# EasyEDA Pro project stm32f103c8t6.eprj, schematic Schematic1
Board Name: Board1; Create Date: 2025-10-09; Page Name: P1; Project Name: 降压模块; Schematic Name: Schematic1; Update Date: 2025-10-12; Company: 嘉立创EDA; Page Size: A4; Version: V1.0
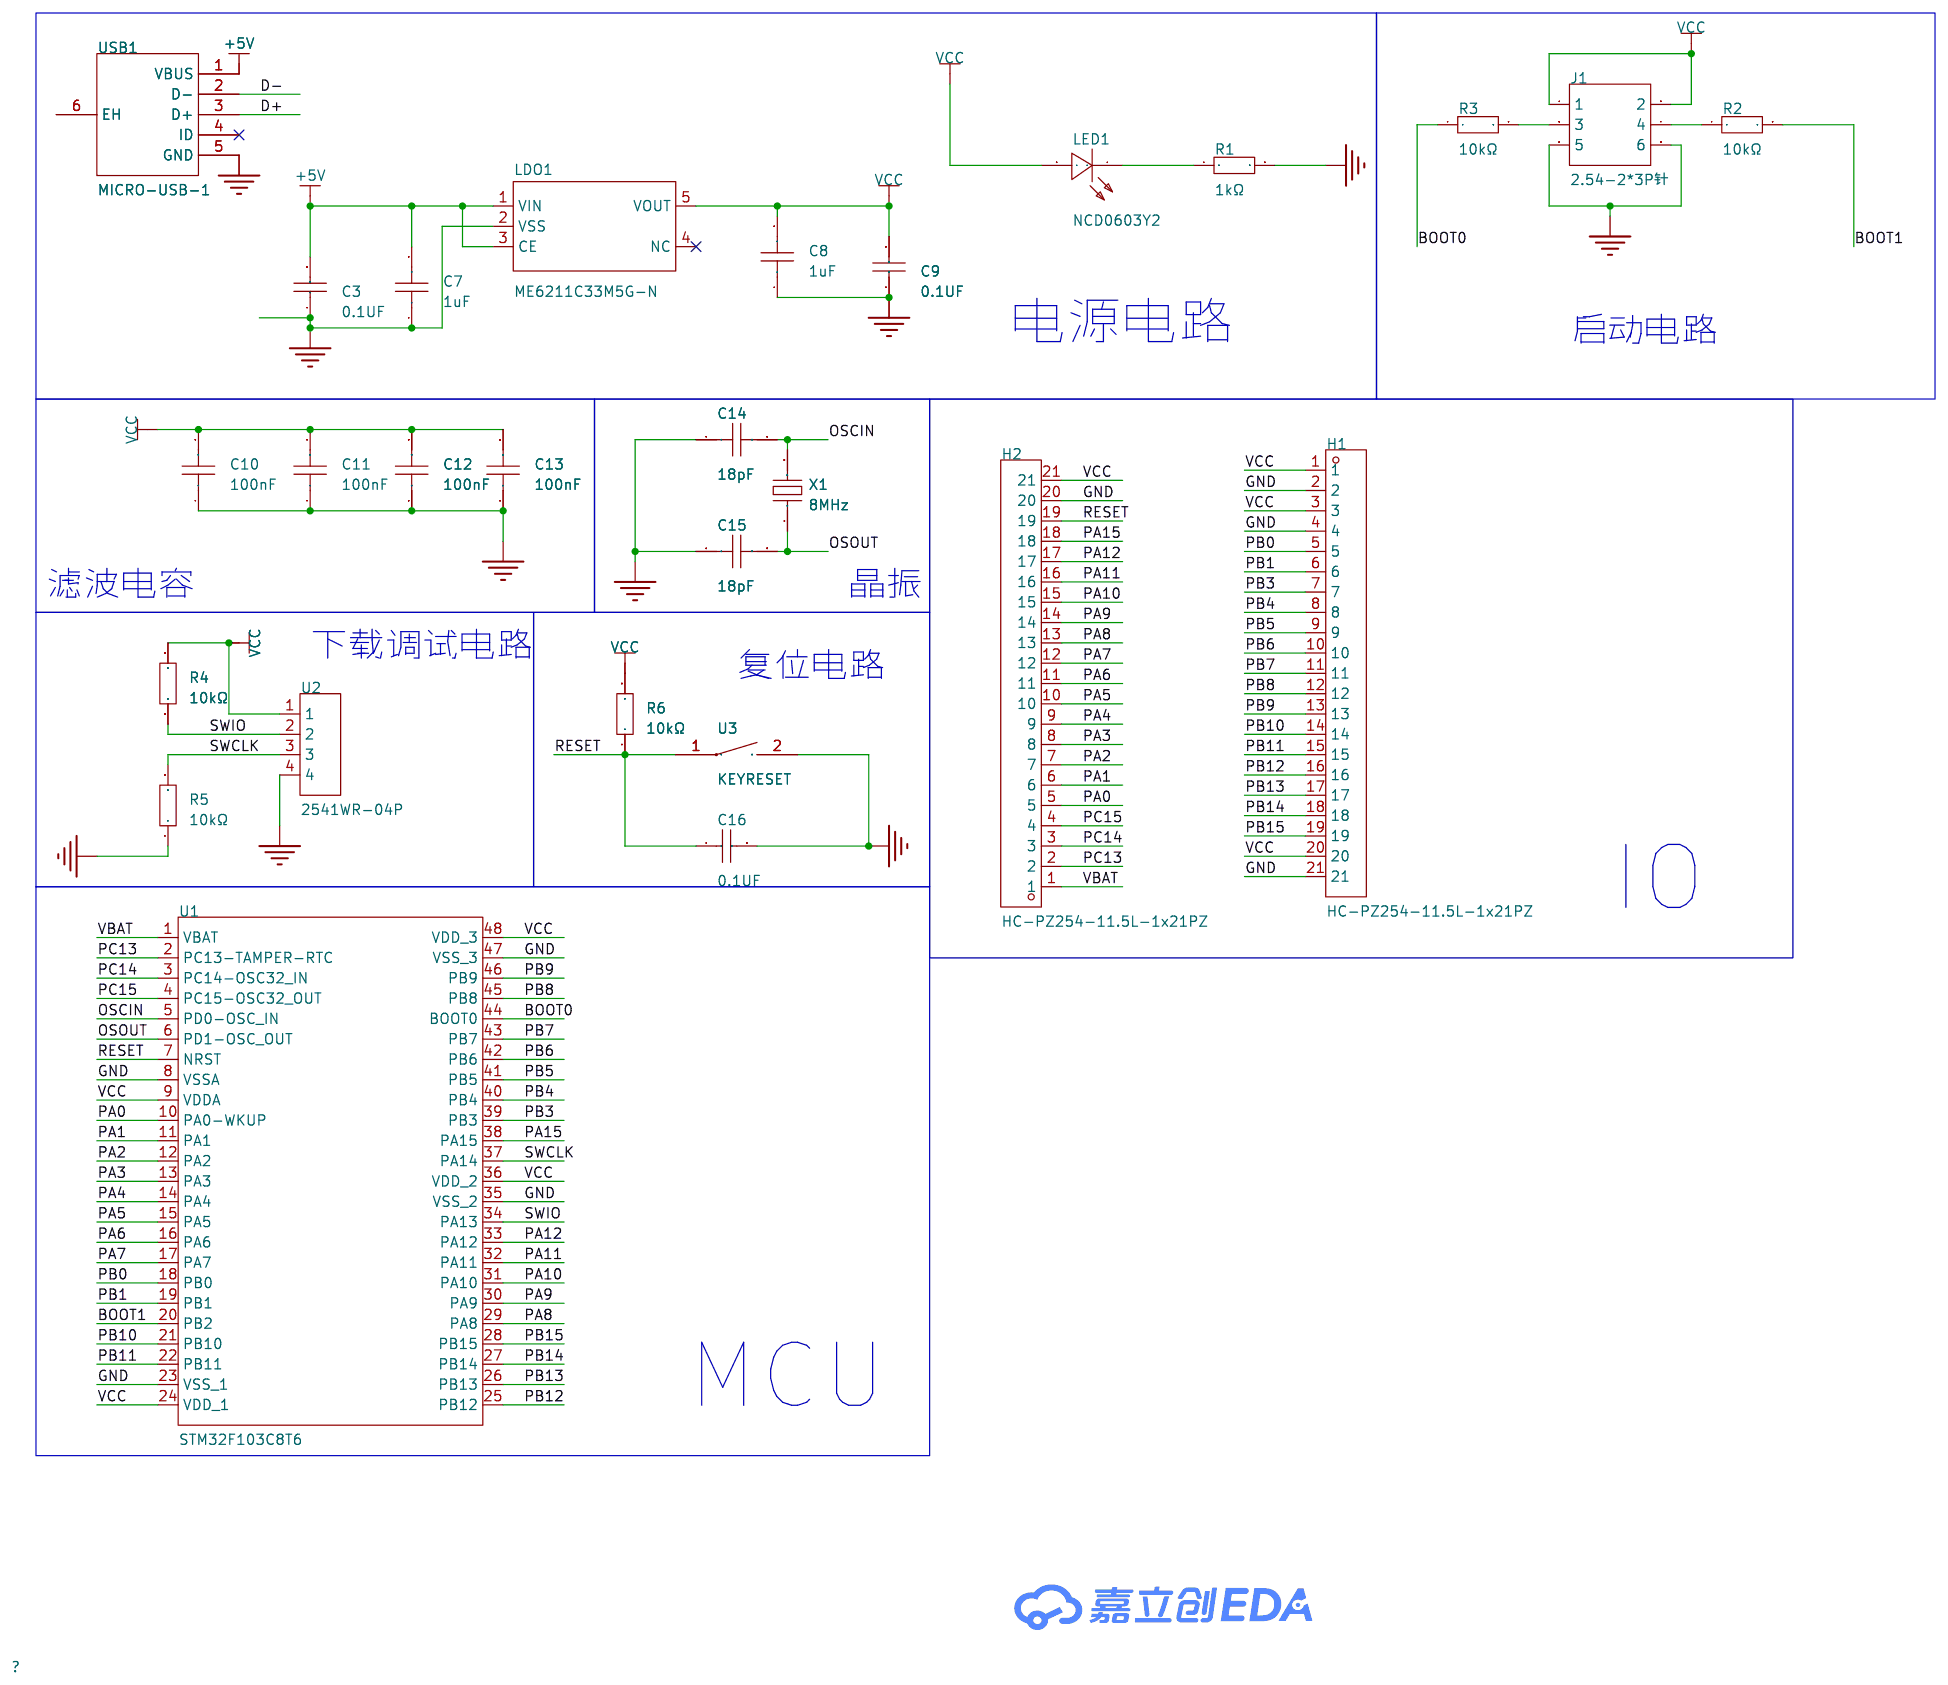
[diagram p0: schematic sheet]

## Parts
C3  0.1UF  [C0603]
C7  1uF  [C0603]
C8  1uF  [C0603]
C9  0.1UF  [C0603]
C10  100nF  [C0402]
C11  100nF  [C0402]
C12  100nF  [C0402]
C13  100nF  [C0402]
C14  18pF  [C0603]
C15  18pF  [C0603]
C16  0.1UF  [C0603]
H1  HC-PZ254-11.5L-1x21PZ  [HDR-TH_21P-P2.54-V-M]
H2  HC-PZ254-11.5L-1x21PZ  [HDR-TH_21P-P2.54-V-M]
J1  2.54-2*3P针  [HDR-TH_6P-P2.54-V-M-R2-C3-S2.54-1]
LDO1  ME6211C33M5G-N  [SOT-23-5_L3.0-W1.7-P0.95-LS2.8-BL]
LED1  NCD0603Y2  [LED0603-RD]
R1  1kΩ  [R0603]
R2  10kΩ  [R0603]
R3  10kΩ  [R0603]
R4  10kΩ  [R0603]
R5  10kΩ  [R0603]
R6  10kΩ  [R0603]
U1  STM32F103C8T6  [LQFP-48_L7.0-W7.0-P0.50-LS9.0-BL]
U2  2541WR-04P  [HDR-TH_4P-P2.54-H-M-W10.4-N]
U3  KEYRESET  [SW-SMD_HX-TS-1101-C-W]
USB1  MICRO-USB-1  [MICRO-USB-SMD_C9900008946]
X1  8MHz  [CRYSTAL-SMD_L7.0-W4.1-LS7.6]

## Library data of the parts
C3 C9 C16 = CAPCER0.1UF16VX5R0603,CAPCER0.1UF25VX5R0603,CAPCER0.1UF16VX7R0603: Supplier Part: C9900012833; JLCPCB Part Class: Extended Part; Supplier: LCSC
C7 C8 = CL10A105KB8NNNC: 容值:1uF;精度:±10%;额定电压:50V;温度系数:X5R;; LCSC Part Name: 1uF ±10% 50V; Supplier Part: C15849; Manufacturer: SAMSUNG(三星); Supplier Footprint: 0603; JLCPCB Part Class: Basic Part; Datasheet: https://item.szlcsc.com/datasheet/CL10A105KB8NNNC/16531.html; Supplier: LCSC; Tolerance: ±10%; Voltage Rating: 50V; Temperature Coefficient: X5R
C10-C13 = CL05B104KB54PNC: 容值:100nF;精度:±10%;额定电压:50V;温度系数:X7R;; LCSC Part Name: 100nF ±10% 50V; Supplier Part: C307331; Manufacturer: SAMSUNG(三星); Supplier Footprint: 0402; JLCPCB Part Class: Basic Part; Datasheet: https://item.szlcsc.com/datasheet/CL05B104KB54PNC/291005.html; Supplier: LCSC; Tolerance: ±10%; Voltage Rating: 50V; Temperature Coefficient: X7R
C14 C15 = TCC0603COG180G500CT: 容值:18pF;精度:±2%;额定电压:50V;温度系数:C0G;; LCSC Part Name: 18pF ±2% 50V; Supplier Part: C5375811; Manufacturer: CCTC(三环); Supplier Footprint: 0603; JLCPCB Part Class: Extended Part; Datasheet: https://item.szlcsc.com/datasheet/TCC0603COG180G500CT/6236321.html; Supplier: LCSC; Tolerance: ±2%; Voltage Rating: 50V; Temperature Coefficient: C0G
H1 H2 = HC-PZ254-11.5L-1x21PZ: 插针结构:1x21P;间距:2.54mm;行距:-;圆针/方针:方针;安装方式:直插;排数:单排;总PIN位数:21P;额定电流:3A;额定电压:-;配合针长度:6mm;塑高:2.5mm;端接针长度:3mm;触头材质:黄铜;触头镀层:金;工作温度:-40℃~+105℃;颜色:黑色;; LCSC Part Name: 1x21P 间距:2.54mm 方针 直插; Supplier Part: C41375940; Manufacturer: HC(虹成电子); Supplier Footprint: 插件,P=2.54mm; Datasheet: https://atta.szlcsc.com/upload/public/pdf/source/20250106/52123F533C0C1BEA0490F50DB21E4BB4.pdf; Supplier: LCSC; Pin Structure: 1x21P; Pitch: 2.54mm; Circluar Pins/Square Pins: 方针; Mounting Type: 直插; Number of Rows: 单排; Number of Pins: 21P; Current Rating: 3A; Length of Mating Pin: 6mm; Insulation Height: 2.5mm; Length of End Connection Pin: 3mm; Contact Material: 黄铜; Contact Plating: 金; Operating Temperature: -40℃~+105℃; Color: 黑色
J1 = 2.54-2*3P针: 插针结构:-;间距:2.54mm;行距:2.54mm;圆针/方针:-;安装方式:直插;排数:双排;总PIN位数:6P;额定电流:-;额定电压:-;配合针长度:-;塑高:-;触头材质:-;触头镀层:-;颜色:黑色;; LCSC Part Name: 间距:2.54mm 直插; Supplier Part: C65114; Manufacturer: BOOMELE(博穆精密); Supplier Footprint: 插件,P=2.54mm; JLCPCB Part Class: Extended Part; Supplier: LCSC; Pitch: 2.54mm; Row Spacing: 2.54mm; Mounting Type: 直插; Number of Rows: 双排; Number of Pins: 6P; Color: 黑色
LDO1 = ME6211C33M5G-N: 输出类型:固定;工作电压:6V;输出电压:3.3V;输出电流:500mA;电源纹波抑制比(PSRR):70dB@(1kHz);输出极性:正极;; LCSC Part Name: 输入6V 输出3.3V 500mA; Supplier Part: C82942; Manufacturer: MICRONE(南京微盟); Supplier Footprint: SOT-23-5; JLCPCB Part Class: Extended Part; Datasheet: https://atta.szlcsc.com/upload/public/pdf/source/20170918/C82942_1505727073070976520.pdf; Supplier: LCSC; Output Type: 固定; Voltage - Supply: 6V; Output Voltage: 3.3V; Output Current: 500mA; Power Supply Rejection Ratio (PSRR): 70dB@(1kHz); Voltage Dropout: 120mV@(100mA); standby current: 60uA; Noise: 50uVrms; Features: 过流保护；带使能；短路保护; Operating Temperature: -40℃~+150℃; Output Configuration: 正极; Number of Outputs: 1
LED1 = NCD0603Y2: 发光颜色:黄色;正向电压(VF):1.6V~2.6V;功率:65mW;正向电流:20mA;主波长:586nm~595nm;透镜颜色:无色透明透镜;发光强度:100mcd~220mcd;发光角度:130°;工作温度:-30℃~+85℃;; Supplier Part: C89811; Manufacturer: 国星光电; Supplier Footprint: 0603; JLCPCB Part Class: Extended Part; Datasheet: https://atta.szlcsc.com/upload/public/pdf/source/20200820/C89811_7FE84B429B6BCA3E113B125EE1452576.pdf; Supplier: LCSC; Emitted Color: 黄色; Forward Voltage (VF): 1.6V~2.6V; Power Dissipation: 65mW; Forward Current: 20mA; Dominant Wavelength: 586nm~595nm; Lens Color: 无色透明透镜; Luminous Intensity: 100mcd~220mcd; Viewing Angle: 130°; Operating Temperature: -30℃~+85℃
R1 = 0603WAF1001T5E: 电阻类型:厚膜电阻;阻值:1kΩ;精度:±1%;功率:100mW;最大工作电压:75V;温度系数:±100ppm/℃;; LCSC Part Name: 1kΩ ±1% 100mW 厚膜电阻; Supplier Part: C21190; Manufacturer: UNI-ROYAL(厚声); Supplier Footprint: 0603; JLCPCB Part Class: Basic Part; Datasheet: https://atta.szlcsc.com/upload/public/pdf/source/20200306/C422600_1E6D84923E4A46A82E41ADD87F860B5C.pdf; Supplier: LCSC; Type: 厚膜电阻; Tolerance: ±1%; Power(Watts): 100mW; Overload Voltage (Max): 75V; Temperature Coefficient: ±100ppm/℃; Operating Temperature Range: -55℃~+155℃
R2-R6 = 0603WAF1002T5E: 电阻类型:厚膜电阻;阻值:10kΩ;精度:±1%;功率:100mW;工作电压:75V;温度系数:±100ppm/℃;; LCSC Part Name: 厚膜电阻 10kΩ ±1% 100mW; Supplier Part: C25804; Manufacturer: UNI-ROYAL(厚声); Supplier Footprint: 0603; JLCPCB Part Class: Basic Part; Datasheet: https://item.szlcsc.com/datasheet/0603WAF1002T5E/26547.html; Supplier: LCSC; Type: 厚膜电阻; Tolerance: ±1%; Power(Watts): 100mW; Voltage-Supply(Max): 75V; Temperature Coefficient: ±100ppm/℃; Operating Temperature: -55℃~+155℃
U1 = STM32F103C8T6: CPU内核:ARM-M3;CPU最大主频:72MHz;应用领域:-;; LCSC Part Name: 主流增强型ARM Cortex-M3 MCU，具有64 KB Flash、72 MHz CPU、电机控制、USB和CAN; Supplier Part: C8734; Manufacturer: ST(意法半导体); Supplier Footprint: LQFP-48(7x7); JLCPCB Part Class: 扩展库; Datasheet: https://item.szlcsc.com/datasheet/STM32F103C8T6/9243.html; Supplier: LCSC; CPU Core: ARM-M3; CPU Maximum Speed: 72MHz; Program Storage Size: 64KB; Program Memory Type: FLASH; Number of I/O: 37; ADC (Bit): 12bit; Voltage - Supply: 2V~3.6V
U2 = 2541WR-04P: 插针结构:1x4P;间距:2.54mm;圆针/方针:方针;安装方式:弯插;排数:单排;总PIN位数:4P;额定电流:3A;配合针长度:6mm;塑高:2.54mm;触头材质:黄铜;触头镀层:金;工作温度:-40℃~+105℃;颜色:黑色;; LCSC Part Name: 1x4P 间距:2.54mm 方针 弯插; Supplier Part: C5383097; Manufacturer: HanElectricity(瀚源); Supplier Footprint: 弯插,P=2.54mm; JLCPCB Part Class: Extended Part; Datasheet: https://item.szlcsc.com/datasheet/2541WR-04P/6258457.html; Supplier: LCSC; Pin Structure: 1x4P; Pitch: 2.54mm; Circluar Pins/Square Pins: 方针; Mounting Type: 弯插; Number of Rows: 单排; Number of Pins: 4P; Current Rating: 3A; Length of Mating Pin: 6mm; Insulation Height: 2.54mm; Contact Material: 黄铜; Contact Plating: 金; Operating Temperature: -40℃~+105℃; Color: 黑色
U3 = HX 3x6x2.5A-2.5N: 电路结构:单刀单掷;按钮形状:方形按钮;作用力:2.5N;安装方式:立贴;开关长度:6mm;开关宽度:3.6mm;开关高度:2.5mm;带支架:不带支架;触点电流:50mA;额定电压:12V;带灯:无;工作寿命:3万次;; LCSC Part Name: 6*3.6*2.5mm 立贴 轻触开关; Supplier Part: C36498960; Manufacturer: hanxia(韩下); Supplier Footprint: SMD,3x6mm; JLCPCB Part Class: Extended Part; Datasheet: https://item.szlcsc.com/datasheet/HX%25203x6x2.5A-2.5N/38220902.html; Supplier: LCSC; Circuit: 单刀单掷; Actuator Style: 方形按钮; Operating Force: 2.5N; Mounting Type: 立贴; Length: 6mm; Width: 3.6mm; Switch Height: 2.5mm; with Bracket: 不带支架; Contact Current: 50mA; Voltage Rating: 12V; Actuator/Cap Color: 白色; With Lamp: 无; Termination Style: SMD接片; Life: 3万次; Operating Temperature: -25℃~+70℃
USB1 = MICRO-USB-1: Supplier Part: C9900008946; Supplier Footprint: USB-micro; JLCPCB Part Class: Extended Part; Supplier: LCSC
X1 = HY8M49SBSMDFB1R30: 频率:8MHz;负载电容:12pF;; LCSC Part Name: 8MHz 12pF; Supplier Part: C5265803; Manufacturer: Huiyuan crystal(惠源晶工); Supplier Footprint: HC-49S-SMD; JLCPCB Part Class: Extended Part; Datasheet: https://item.szlcsc.com/datasheet/HY8M49SBSMDFB1R30/5991202.html; Supplier: LCSC; Load Capacitance: 12pF

## Nets
+5V: C3.2 C7.2 LDO1.1(VIN) LDO1.3(CE) USB1.1(VBUS)
GND: C3.1 C7.1 C8.1 C9.1 C10.1 C11.1 C12.1 C13.1 C14.1 C15.1 C16.2 H1.2 H1.4 H1.21 H2.20 J1.5 J1.6 LDO1.2(VSS) R1.2 R5.1 U1.8(VSSA) U1.23(VSS_1) U1.35(VSS_2) U1.47(VSS_3) U2.4 U3.2 USB1.5(GND)
VBAT: H2.1 U1.1(VBAT)
VCC: C8.2 C9.2 C10.2 C11.2 C12.2 C13.2 H1.1 H1.3 H1.20 H2.21 J1.1 J1.2 LDO1.5(VOUT) LED1.2(A) R4.2 R6.2 U1.9(VDDA) U1.24(VDD_1) U1.36(VDD_2) U1.48(VDD_3) U2.1
BOOT0: R3.1 U1.44(BOOT0)
BOOT1: R2.2 U1.20(PB2)
D+: USB1.3(D+)
D-: USB1.2(D-)
OSCIN: C14.2 U1.5(PD0-OSC_IN) X1.2
OSOUT: C15.2 U1.6(PD1-OSC_OUT) X1.1
PA0: H2.5 U1.10(PA0-WKUP)
PA1: H2.6 U1.11(PA1)
PA2: H2.7 U1.12(PA2)
PA3: H2.8 U1.13(PA3)
PA4: H2.9 U1.14(PA4)
PA5: H2.10 U1.15(PA5)
PA6: H2.11 U1.16(PA6)
PA7: H2.12 U1.17(PA7)
PA8: H2.13 U1.29(PA8)
PA9: H2.14 U1.30(PA9)
PA10: H2.15 U1.31(PA10)
PA11: H2.16 U1.32(PA11)
PA12: H2.17 U1.33(PA12)
PA15: H2.18 U1.38(PA15)
PB0: H1.5 U1.18(PB0)
PB1: H1.6 U1.19(PB1)
PB3: H1.7 U1.39(PB3)
PB4: H1.8 U1.40(PB4)
PB5: H1.9 U1.41(PB5)
PB6: H1.10 U1.42(PB6)
PB7: H1.11 U1.43(PB7)
PB8: H1.12 U1.45(PB8)
PB9: H1.13 U1.46(PB9)
PB10: H1.14 U1.21(PB10)
PB11: H1.15 U1.22(PB11)
PB12: H1.16 U1.25(PB12)
PB13: H1.17 U1.26(PB13)
PB14: H1.18 U1.27(PB14)
PB15: H1.19 U1.28(PB15)
PC13: H2.2 U1.2(PC13-TAMPER-RTC)
PC14: H2.3 U1.3(PC14-OSC32_IN)
PC15: H2.4 U1.4(PC15-OSC32_OUT)
RESET: C16.1 H2.19 R6.1 U1.7(NRST) U3.1
SWCLK: R5.2 U1.37(PA14) U2.3
SWIO: R4.1 U1.34(PA13) U2.2
$1N3316: J1.3 R3.2
$1N3320: J1.4 R2.1
Net-(LED1-1): LED1.1(K) R1.1

Not connected (* = marked no-connect by the designer): LDO1 4(NC)*; USB1 4(ID)* 6(EH)

## Notes on the sheet
- 电源电路
- 启动电路
- 滤波电容
- 晶振
- 下载调试电路
- 复位电路
- IO
- MCU
